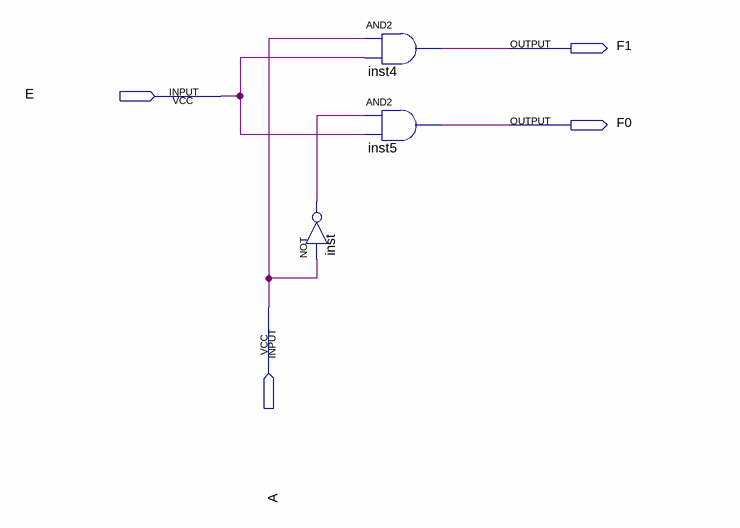
[diagram p0: schematic sheet]
// Quartus schematic decoder_1x2.bdf as structural Verilog: 3 symbols, 4 pins
module decoder_1x2 (
  input  E,
  input  A,
  output F1,
  output F0
);

  wire inst_out;

  and inst4 (F1, A, E);
  and inst5 (F0, inst_out, E);
  not inst (inst_out, A);
endmodule
